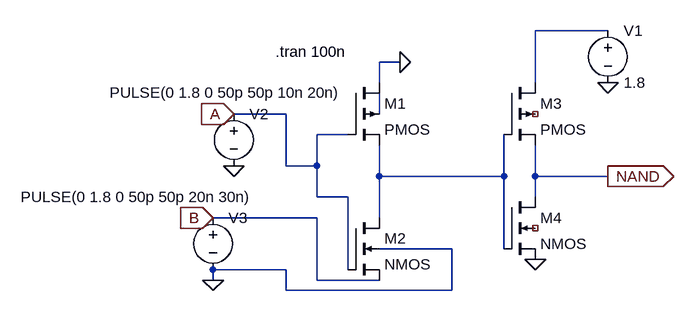
[diagram p0: schematic NAND.asc]
NAND.asc, the LTspice schematic file:
Version 4.1
SHEET 1 880 680
WIRE 560 -32 448 -32
WIRE 240 16 208 16
WIRE 208 48 208 16
WIRE 448 48 448 -32
WIRE 64 96 -16 96
WIRE 208 96 208 64
WIRE 160 128 112 128
WIRE 64 176 64 96
WIRE 112 176 112 128
WIRE 112 176 64 176
WIRE 208 192 208 144
WIRE 400 192 400 128
WIRE 400 192 208 192
WIRE 448 192 448 144
WIRE 560 192 448 192
WIRE 112 224 112 176
WIRE 160 224 112 224
WIRE 448 224 448 192
WIRE 112 256 -48 256
WIRE 208 256 208 192
WIRE 320 304 208 304
WIRE 400 304 400 192
WIRE 64 336 -48 336
WIRE 160 336 160 224
WIRE -48 352 -48 336
WIRE 112 352 112 256
WIRE 208 352 112 352
WIRE 64 368 64 336
WIRE 320 368 320 304
WIRE 320 368 64 368
FLAG -16 176 0
FLAG 240 16 0
FLAG -16 96 A
IOPIN -16 96 In
FLAG -48 256 B
IOPIN -48 256 In
FLAG 560 192 NAND
IOPIN 560 192 Out
FLAG -48 352 0
FLAG 448 320 0
FLAG 560 48 0
SYMBOL pmos4 160 48 R0
SYMATTR InstName M1
SYMBOL nmos4 160 256 R0
SYMATTR InstName M2
SYMBOL voltage -16 80 R0
WINDOW 3 -191 -17 Left 2
WINDOW 123 0 0 Left 0
WINDOW 39 0 0 Left 0
SYMATTR Value PULSE(0 1.8 0 50p 50p 10n 20n)
SYMATTR InstName V2
SYMBOL voltage -48 240 R0
WINDOW 3 -296 -16 Left 2
WINDOW 123 0 0 Left 0
WINDOW 39 0 0 Left 0
SYMATTR Value PULSE(0 1.8 0 50p 50p 20n 30n)
SYMATTR InstName V3
SYMBOL pmos4 400 48 R0
SYMATTR InstName M3
SYMBOL nmos4 400 224 R0
SYMATTR InstName M4
SYMBOL voltage 560 -48 R0
WINDOW 123 0 0 Left 0
WINDOW 39 0 0 Left 0
SYMATTR InstName V1
SYMATTR Value 1.8
TEXT 48 0 Left 2 !.tran 100n

The netlist it stands for:
* NAND.asc
M1 0 A N003 N002 PMOS
M2 N003 A B 0 NMOS
V2 A 0 PULSE(0 1.8 0 50p 50p 10n 20n)
V3 B 0 PULSE(0 1.8 0 50p 50p 20n 30n)
M3 N001 N003 NAND NC_01 PMOS
M4 NAND N003 0 NC_02 NMOS
V1 N001 0 1.8
.model NMOS NMOS
.model PMOS PMOS
.lib standard.mos
.tran 100n
.backanno
.end